# EAGLE schematic hemera_charger_A (EAGLE 6.1)
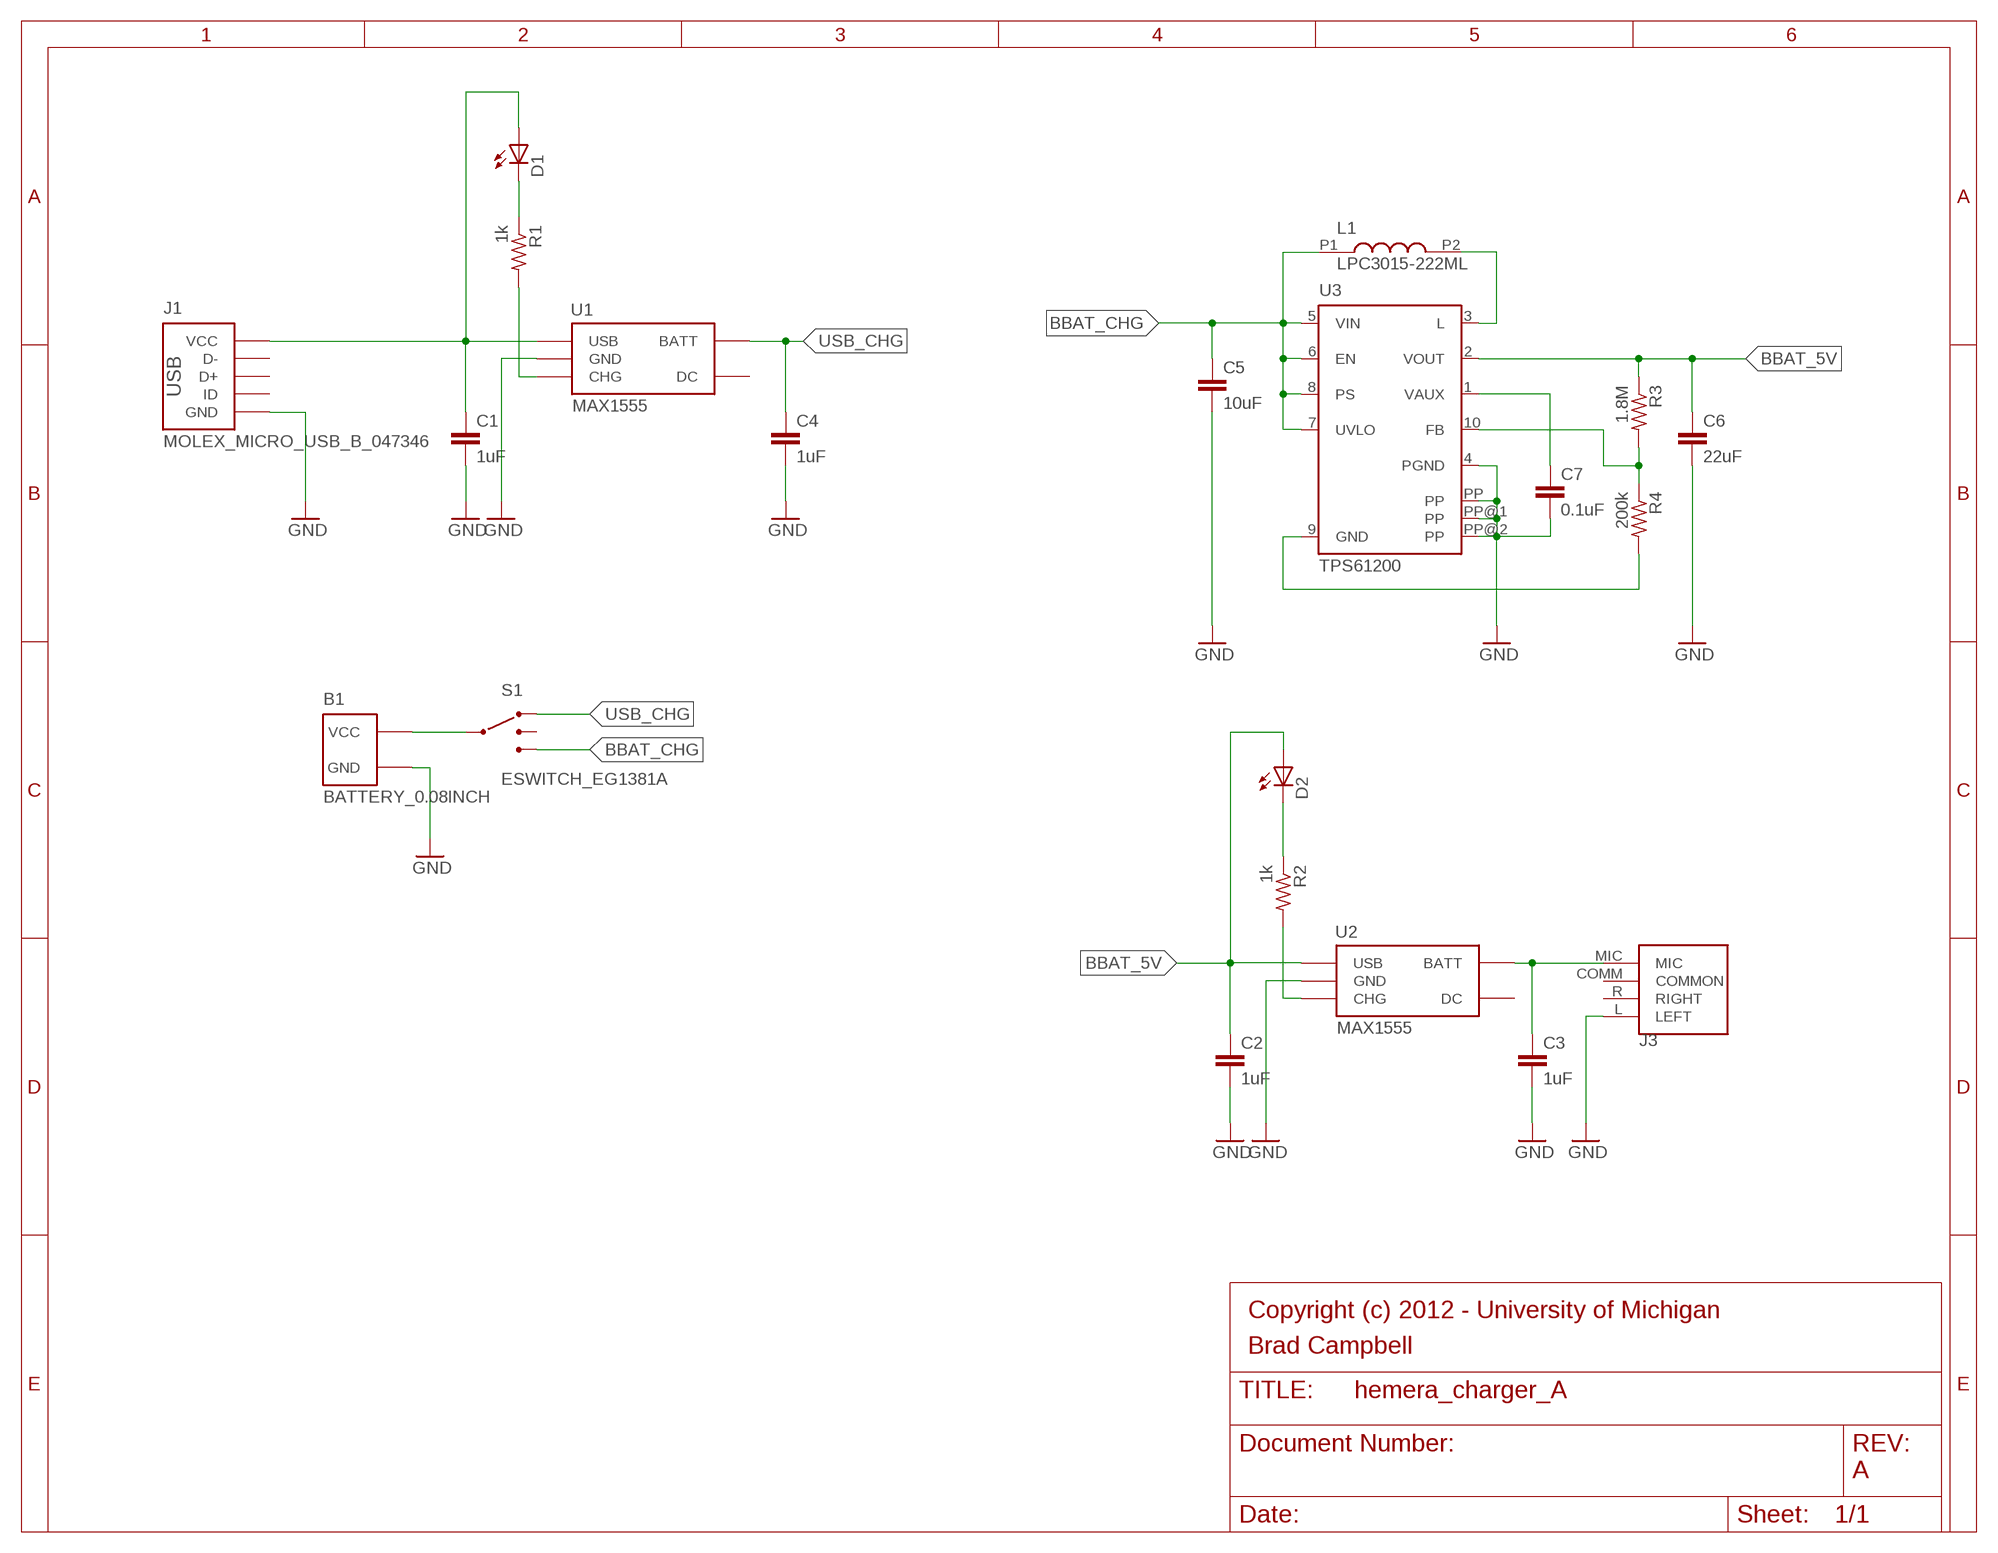
[diagram p0: schematic, sheet 1]

## Parts
B1  BATTERY_0.08INCH  [BATTERY_0.08INCH]
C1  1uF  C-EUC0603  [C0603]
C2  1uF  C-EUC0603  [C0603]
C3  1uF  C-EUC0603  [C0603]
C4  1uF  C-EUC0603  [C0603]
C5  10uF  C-EUC0603  [C0603]
C6  22uF  C-EUC0603  [C0603]
C7  0.1uF  C-EUC0603  [C0603]
D1  LED0603  [LED-0603]
D2  LED0603  [LED-0603]
J1  MOLEX_MICRO_USB_B_047346  [MOLEX_MICRO_USB_B_047346]
J3  3.5JACK4CONNSUNSTONE_QUICKTURN  [PLUGBOARDCONNECTOR_SUNSTONE]
L1  LPC3015-222ML  LPC3015  [LPS3015]
R1  1k  R-US_R0603  [R0603]
R2  1k  R-US_R0603  [R0603]
R3  1.8M  R-US_R0603  [R0603]
R4  200k  R-US_R0603  [R0603]
S1  ESWITCH_EG1381A  [ESWITCH_EG1381]
U1  MAX1555  [SOT23-5]
U2  MAX1555  [SOT23-5]
U3  TPS61200  [S-PDSO-N10]

## Nets
BBAT: B1.POS(VCC) S1.3
BBAT_5V: C2.1 C6.1 D2.A R3.1 U2.1(USB) U3.2(VOUT)
BBAT_CHG: C5.1 L1.P1 S1.4 U3.5(VIN) U3.6(EN) U3.7(UVLO) U3.8(PS)
FB: R3.2 R4.1 U3.10(FB)
GND: B1.NEG(GND) C1.2 C2.2 C3.2 C4.2 C5.2 C6.2 C7.2 J1.GND J3.L(LEFT) U1.2(GND) U2.2(GND) U3.4(PGND) U3.PP U3.PP@1(PP) U3.PP@2(PP)
L: L1.P2 U3.3(L)
N$1: C1.1 D1.A J1.VCC U1.1(USB)
N$2: R2.2 U2.3(CHG)
N$3: C3.1 J3.MIC U2.5(BATT)
N$4: R1.2 U1.3(CHG)
N$5: D1.C R1.1
N$6: R4.2 U3.9(GND)
N$7: D2.C R2.1
USB_CHG: C4.1 S1.1 U1.5(BATT)
VAUX: C7.1 U3.1(VAUX)
Unconnected: J1.D+ J1.D- J1.ID J3.R(RIGHT) S1.2 U1.4(DC) U2.4(DC)

## Notes on the sheet
- Copyright (c) 2012 - University of Michigan
- Brad Campbell
- A

## Power pins joined to a net without a drawn wire
COMMON: J3.COMM(COMMON)

## Library data of the parts
B1 = brad:BATTERY_0.08INCH
C1-C7 = rcl:C-EU: CAPACITOR, European symbol
D1 D2 = berkeley-epic:LED: LEDs Standard schematic elements and footprints for 5mm, 3mm, 1206, and 0603 sized LEDs. 5mm - Spark Fun Electronics SKU : COM-00529 (and others)
J1 = brad:MOLEX_MICRO_USB_B_047346
J3 = Thomas:3.5JACK4CONN
L1 = fm_usb_receiver:LPC3015
R1-R4 = rcl:R-US_: RESISTOR, American symbol
S1 = brad:ESWITCH_EG1381A
U1 U2 = brad:MAX1555
U3 = texas:TPS6120*: LOW INPUT VOLTAGE SYNCHRONOUS BOOST CONVERTER WITH 1.3-A SWITCHES Source: http://focus.ti.com/lit/ds/symlink/tps61200.pdf; MPN: TPS61200DRCT; OC_FARNELL: 1471238; OC_NEWARK: 37M0066